# EasyEDA schematic Schematic.json
TITLE: Christmas Tree Board; REV: 1.0; Date: 2019-10-04; Sheet: 1/1; Drawn By: Liam Smolenaars; Company: McMaster IEEE Comp. Chapter
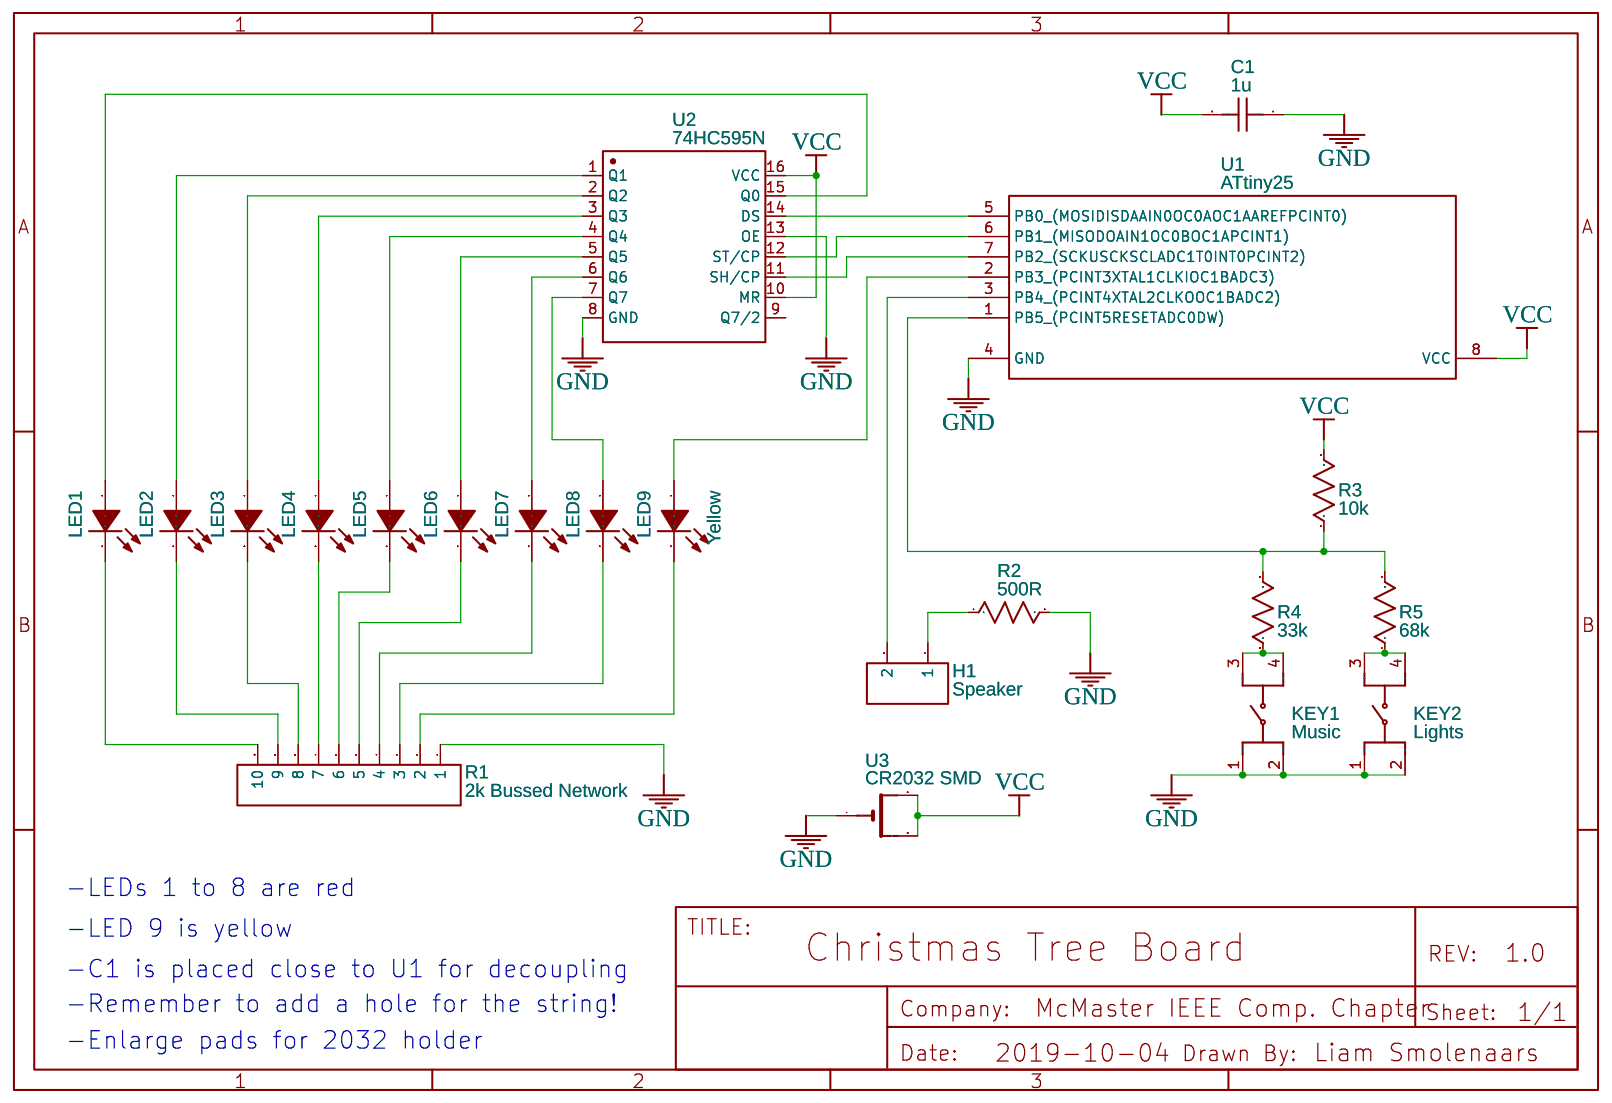
[diagram p0: schematic sheet]

## Parts
C1  1u  [RAD-0.1]
H1  Speaker  [HDR-2X1/2.54]
KEY1  Music  [KEY-6.0*6.0-2]
KEY2  Lights  [KEY-6.0*6.0-2]
LED1  204-10SURD/S530-A3  [LED-3MM/2.54]
LED2  204-10SURD/S530-A3  [LED-3MM/2.54]
LED3  204-10SURD/S530-A3  [LED-3MM/2.54]
LED4  204-10SURD/S530-A3  [LED-3MM/2.54]
LED5  204-10SURD/S530-A3  [LED-3MM/2.54]
LED6  204-10SURD/S530-A3  [LED-3MM/2.54]
LED7  204-10SURD/S530-A3  [LED-3MM/2.54]
LED8  204-10SURD/S530-A3  [LED-3MM/2.54]
LED9  Yellow  [LED-3MM/2.54]
R1  2k Bussed Network  [HDR-TH_10PIN-V-FEMALE-PITCH2.54]
R2  500R  [AXIAL-0.4]
R3  10k  [AXIAL-0.4]
R4  33k  [AXIAL-0.4]
R5  68k  [AXIAL-0.4]
U1  ATtiny25  [DIP8]
U2  74HC595N  [DIP16]
U3  CR2032 SMD  [CR2032 SMD HOLDER]

## Library data of the parts
C1 = Cap_RAD-0.1_US
H1 = -: Supplier: LCSC; Manufacturer: TE Connectivity; Manufacturer Part: 826629-2; image: //image.lceda.cn/szlcsc/C86471.jpg; Supplier Part: C86471
KEY1 KEY2 = -: Supplier: LCSC; Manufacturer: SOFNG; Manufacturer Part: TS-1102-5016; Contributor: EasyEDA; Supplier Part: C111609
LED1-LED8 = -: Supplier: LCSC; Manufacturer: EVERLIGHT; Supplier Part: C99772
LED9 = -: Supplier: LCSC; Manufacturer: EVERLIGHT; Manufacturer Part: 204-10SURD/S530-A3; Supplier Part: C99772
R1 = -: Supplier: LCSC; Manufacturer: BOOMELE; Manufacturer Part: 2.54mm 1*10P Straight Female header Gold-plated; Supplier Part: C35445
R2-R5 = Res_0805(1/8W)_US
U1 = -: 8-bit AVR Microcontroller, 10MHz, 1.8-5.5V, 8K Flash, 512 Bytes EEPROM, 512 Bytes SRAM, Industrial Grade (-40u7648 to 85u7648), 8-Lead PDIP, Pb-Free
U3 = -: Contributor: Adafruit

## Nets
GND: C1.1 KEY1.1 KEY1.2 KEY2.1 KEY2.2 R1.1 R2.2 U1.4(GND) U2.8(GND) U2.13(OE) U3.-
VCC: C1.2 R3.2 U1.8(VCC) U2.10(MR) U2.16(VCC) U3.+1(+) U3.+2(+1)
Net-(H1-1): H1.1 R2.1
Net-(H1-2): H1.2 U1.3(PB4 (PCINT4XTAL2CLKOOC1BADC2))
Net-(KEY1-3): KEY1.3 KEY1.4 R4.1
Net-(KEY2-3): KEY2.3 KEY2.4 R5.1
Net-(LED1-1): LED1.1(A) U2.15(Q0)
Net-(LED1-2): LED1.2(K) R1.10
Net-(LED2-1): LED2.1(A) U2.1(Q1)
Net-(LED2-2): LED2.2(K) R1.9
Net-(LED3-1): LED3.1(A) U2.2(Q2)
Net-(LED3-2): LED3.2(K) R1.8
Net-(LED4-1): LED4.1(A) U2.3(Q3)
Net-(LED4-2): LED4.2(K) R1.7
Net-(LED5-1): LED5.1(A) U2.4(Q4)
Net-(LED5-2): LED5.2(K) R1.6
Net-(LED6-1): LED6.1(A) U2.5(Q5)
Net-(LED6-2): LED6.2(K) R1.5
Net-(LED7-1): LED7.1(A) U2.6(Q6)
Net-(LED7-2): LED7.2(K) R1.4
Net-(LED8-1): LED8.1(A) U2.7(Q7)
Net-(LED8-2): LED8.2(K) R1.3
Net-(LED9-1): LED9.1(A) U1.2(PB3 (PCINT3XTAL1CLKIOC1BADC3))
Net-(LED9-2): LED9.2(K) R1.2
Net-(R3-1): R3.1 R4.2 R5.2 U1.1(PB5 (PCINT5RESETADC0DW))
Net-(U1-5): U1.5(PB0 (MOSIDISDAAIN0OC0AOC1AAREFPCINT0)) U2.14(DS)
Net-(U1-6): U1.6(PB1 (MISODOAIN1OC0BOC1APCINT1)) U2.12(ST/CP)
Net-(U1-7): U1.7(PB2 (SCKUSCKSCLADC1T0INT0PCINT2)) U2.11(SH/CP)

Not connected (* = marked no-connect by the designer): U2 9(Q7/2)

## Notes on the sheet
- -LEDs 1 to 8 are red
- -LED 9 is yellow
- -C1 is placed close to U1 for decoupling
- -Remember to add a hole for the string!
- -Enlarge pads for 2032 holder
